# EAGLE design Mini560 (EAGLE 9.6.2)
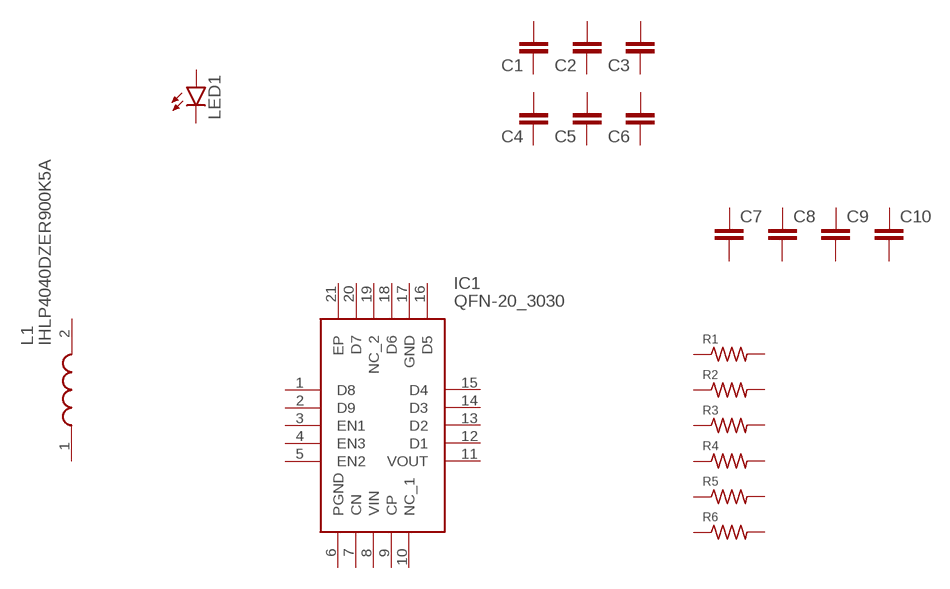
[diagram p0: schematic, sheet 1]

## Parts
C1  C1206  [C1206]
C2  C1206  [C1206]
C3  C1206  [C1206]
C4  C1206  [C1206]
C5  C1206  [C1206]
C6  C1206  [C1206]
C7  C0603  [C0603]
C8  C0603  [C0603]
C9  C0603  [C0603]
C10  C0603  [C0603]
IC1  QFN-20_3030  [QFN-20_3030]
L1  IHLP4040DZER900K5A  [IHLP4040DZER900K5A]
LED1  LED-0603-W  [LED-0603-W]
R1  R0603  [R0603]
R2  R0603  [R0603]
R3  R0603  [R0603]
R4  R0603  [R0603]
R5  R0603  [R0603]
R6  R0603  [R0603]
Unconnected: C1.1 C1.2 C2.1 C2.2 C3.1 C3.2 C4.1 C4.2 C5.1 C5.2 C6.1 C6.2 C7.1 C7.2 C8.1 C8.2 C9.1 C9.2 C10.1 C10.2 IC1.1(D8) IC1.2(D9) IC1.3(EN1) IC1.4(EN3) IC1.5(EN2) IC1.6(PGND) IC1.7(CN) IC1.8(VIN) IC1.9(CP) IC1.10(NC_1) IC1.11(VOUT) IC1.12(D1) IC1.13(D2) IC1.14(D3) IC1.15(D4) IC1.16(D5) IC1.17(GND) IC1.18(D6) IC1.19(NC_2) IC1.20(D7) IC1.21(EP) L1.1 L1.2 LED1.1(C) LED1.2(A) R1.1 R1.2 R2.1 R2.2 R3.1 R3.2 R4.1 R4.2 R5.1 R5.2 R6.1 R6.2

## Library data of the parts
C1-C6 = Capacitors:C1206
C7-C10 = Capacitors:C0603
IC1 = IntegratedCircuits:QFN-20_3030: LED Lighting Drivers High EFF 2.7V - 5.5V 3-Ch White LED 20mA Source: Datasheet <https://4donline.ihs.com/images/VipMasterIC/IC/DIOD/DIODS13400/DIODS13400-1.pdf?hkey=EF798316E3902B6ED9A73243A3159BB0>; DESCRIPTION: LED Lighting Drivers High EFF 2.7V - 5.5V 3-Ch White LED 20mA; HEIGHT: 0.63mm; MANUFACTURER_NAME: Diodes Inc.; MANUFACTURER_PART_NUMBER: AL3158FSG-7
L1 = Inductor:IHLP4040DZER900K5A: Fixed Inductors 90uH 20% High Temp AEC-Q200 Source: Datasheet <https://www.vishay.com/doc?34315>; DESCRIPTION: Fixed Inductors 90uH 20% High Temp AEC-Q200; HEIGHT: 4mm; MANUFACTURER_NAME: Vishay; MANUFACTURER_PART_NUMBER: IHLP4040DZER900K5A; MOUSER_PART_NUMBER: 70-IHLP4040DZR900K5A; MOUSER_PRICE-STOCK: https://www.mouser.co.uk/ProductDetail/Vishay-Dale/IHLP4040DZER900K5A?qs=tDDpbAIEejpNSzub2exd5g%3D%3D
LED1 = LED:LED-0603
R1-R6 = Resistors:R0603

## Board
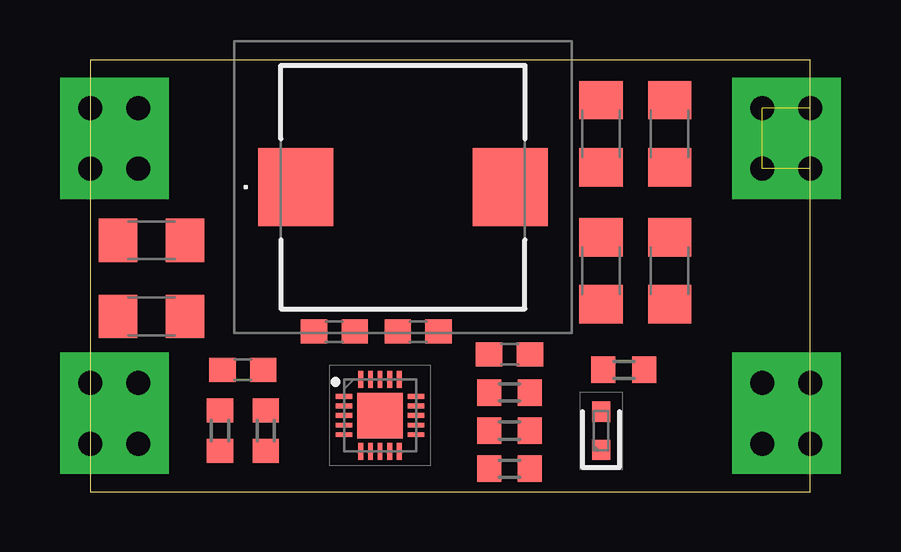
[diagram p1: board, top side]
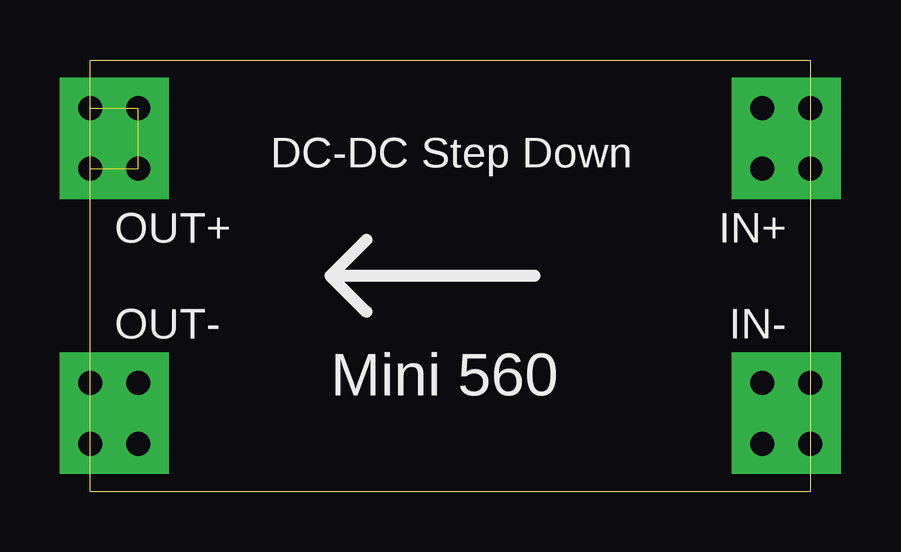
[diagram p2: board, bottom side, seen from below]

Size 30 x 18 mm. Coordinates in mm from the lower left corner, seen from the top.
Outline: 0,0 30,0 30,18 0,18 0,0
Copper layers (1*16): Top 0.035mm / dielectric 1.5mm / Bottom 0.035mm
Design rules "default": minimum track width 6mil, minimum drill 0.35mm, track to track 6mil, track to pad 6mil, pad to pad 6mil, via to via 6mil, smd to smd 6mil, copper to edge 40mil, drill to drill 6mil, minimum pad ring 10mil, minimum via ring 8mil, stop-mask expansion 4mil, vias tented up to drill 0mil, thermal gap 10mil

### Footprints (pad centres in the part's own frame; a part is rotated, then mirrored left to right if it is on the bottom)
C1206 = smd 1.6 x 1.8: 1 -1.4,0; 2 1.4,0
C0603 = smd 1.1 x 1: 1 -0.85,0; 2 0.85,0
QFN-20_3030 = smd 0.7 x 0.2: 1 -1.5,0.8; 2 -1.5,0.4; 3 -1.5,0; 4 -1.5,-0.4; 5 -1.5,-0.8; 11 1.5,-0.8; 12 1.5,-0.4; 13 1.5,0; 14 1.5,0.4; 15 1.5,0.8 | smd 0.2 x 0.7: 6 -0.8,-1.5; 7 -0.4,-1.5; 8 0,-1.5; 9 0.4,-1.5; 10 0.8,-1.5; 16 0.8,1.5; 17 0.4,1.5; 18 0,1.5; 19 -0.4,1.5; 20 -0.8,1.5 | smd 1.9 x 1.9: 21 0,0
IHLP4040DZER900K5A = smd 3.124 x 3.251: 1 -4.471,0; 2 4.471,0
LED-0603-W = smd 0.85 x 0.75: 1 -0.8,0; 2 0.8,0
R0603 = smd 1 x 1.1: 1 -0.85,0; 2 0.85,0

### Placement (x,y rotation side)
C1  2.54,10.48 0 top
C2  2.54,7.3 0 top
C3  21.27,14.92 270 top
C4  24.13,14.92 270 top
C5  21.27,9.21 270 top
C6  24.13,9.21 270 top
C7  6.35,5.08 0 top
C8  10.16,6.67 180 top
C9  13.65,6.67 180 top
C10  17.46,5.71 0 top
IC1  12.06,3.17 0 top
L1  13.02,12.7 0 top
LED1  21.27,2.54 90 top
R1  5.4,2.54 90 top
R2  7.3,2.54 90 top
R3  17.46,4.13 0 top
R4  17.46,2.54 0 top
R5  17.46,0.95 0 top
R6  22.23,5.08 0 top

### Tracks (layer width: path | path; a pad name or v marks a point on that pad's centre or on a via)
N$1  (via drill 1 pad 2.54)
  other vias: 0,2
N$2  (via drill 1 pad 2.54)
  other vias: 0,4.54
N$3  (via drill 1 pad 2.54)
  other vias: 0,13.46
N$4  (via drill 1 pad 2.54)
  other vias: 0,16
N$5  (via drill 1 pad 2.54)
  other vias: 2,2
N$6  (via drill 1 pad 2.54)
  other vias: 28,2
N$7  (via drill 1 pad 2.54)
  other vias: 30,2
N$8  (via drill 1 pad 2.54)
  other vias: 2,4.54
N$9  (via drill 1 pad 2.54)
  other vias: 2,13.46
N$10  (via drill 1 pad 2.54)
  other vias: 2,16
N$11  (via drill 1 pad 2.54)
  other vias: 28,4.54
N$16  (via drill 1 pad 2.54)
  other vias: 30,4.54
OUT+  (via drill 1 pad 2.54)  (3 unrouted)
  other vias: 28,16 30,16 28,13.46 30,13.46

### Text on the board
bPlace: DC-DC Step Down | IN+ | OUT+ | IN- | OUT- | Mini 560